# Altium schematic sheet 05. eMMC.SchDoc
size A3; DocumentNumber: 6; SheetNumber: 6; SheetTotal: 12
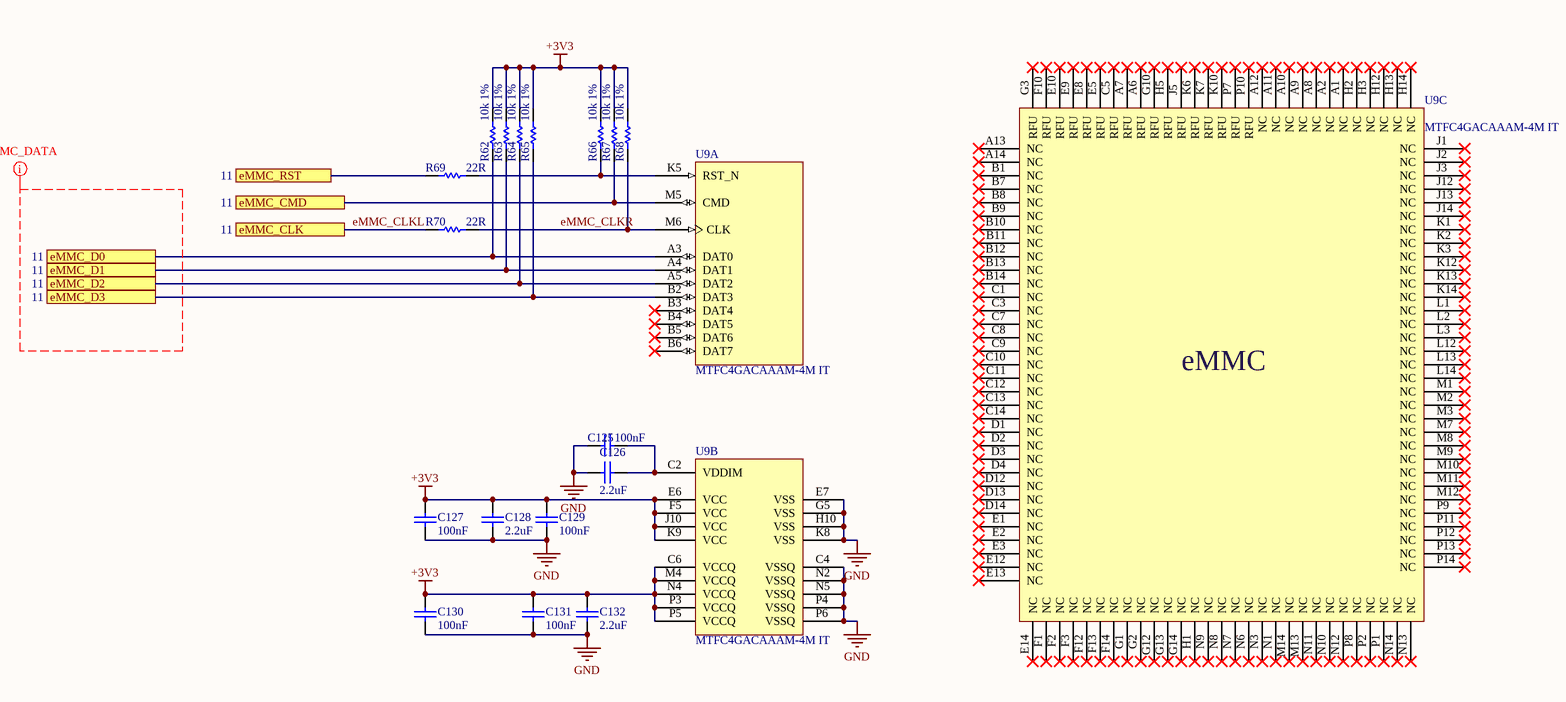
[diagram p0: 05. eMMC.SchDoc]

## Parts
C125  100nF  [CAPC1005X60X30LL05T10]
C126  2.2uF  [CAPC1608X90X35ML10T15]
C127  100nF  [CAPC1005X60X30LL05T10]
C128  2.2uF  [CAPC1005X60X30LL05T10]
C129  100nF  [CAPC1005X60X30LL05T10]
C130  100nF  [CAPC1005X60X30LL05T10]
C131  100nF  [CAPC1005X60X30LL05T10]
C132  2.2uF  [CAPC1608X90X35ML10T15]
R62  10k 1%  [RESC1005X40X25LL05T05]
R63  10k 1%  [RESC1005X40X25LL05T05]
R64  10k 1%  [RESC1005X40X25LL05T05]
R65  10k 1%  [RESC1005X40X25LL05T05]
R66  10k 1%  [RESC1005X40X25LL05T05]
R67  10k 1%  [RESC1005X40X25LL05T05]
R68  10k 1%  [RESC1005X40X25LL05T05]
R69  22R  [RESC1005X40X25LL05T05]
R70  22R  [RESC1005X40X25LL05T05]
U9  MTFC4GACAAAM-4M IT  [VFBGA-153]  (parts A,B,C of 3)

## Ports
eMMC_CLK (see 11), eMMC_CMD (see 11), eMMC_D0 (see 11), eMMC_D1 (see 11), eMMC_D2 (see 11), eMMC_D3 (see 11), eMMC_RST (see 11)

## Nets
+3V3: C127.2 C128.2 C129.2 C130.2 C131.2 C132.2 R62.2 R63.2 R64.2 R65.2 R66.2 R67.2 R68.2 U9.C6(VCCQ) U9.E6(VCC) U9.F5(VCC) U9.J10(VCC) U9.K9(VCC) U9.M4(VCCQ) U9.N4(VCCQ) U9.P3(VCCQ) U9.P5(VCCQ)
GND: C125.2 C126.2 C127.1 C128.1 C129.1 C130.1 C131.1 C132.1 U9.C4(VSSQ) U9.E7(VSS) U9.G5(VSS) U9.H10(VSS) U9.K8(VSS) U9.N2(VSSQ) U9.N5(VSSQ) U9.P4(VSSQ) U9.P6(VSSQ)
eMMC_CLKL: R70.1 ; port eMMC_CLK
eMMC_CLKR: R68.1 R70.2 U9.M6(CLK)
eMMC_CMD: R67.1 U9.M5(CMD) ; port eMMC_CMD
eMMC_D0: R62.1 U9.A3(DAT0) ; port eMMC_D0
eMMC_D1: R63.1 U9.A4(DAT1) ; port eMMC_D1
eMMC_D2: R64.1 U9.A5(DAT2) ; port eMMC_D2
eMMC_D3: R65.1 U9.B2(DAT3) ; port eMMC_D3
eMMC_RST: R69.1 ; port eMMC_RST
NetC125_1: C125.1 C126.1 U9.C2(VDDIM)
NetR66_1: R66.1 R69.2 U9.K5(RST_N)

Not connected (* = marked no-connect by the designer): U9 A1(NC)* A2(NC)* A6(RFU)* A7(RFU)* A8(NC)* A9(NC)* A10(NC)* A11(NC)* A12(NC)* A13(NC)* A14(NC)* B1(NC)* B3(DAT4)* B4(DAT5)* B5(DAT6)* B6(DAT7)* B7(NC)* B8(NC)* B9(NC)* B10(NC)* B11(NC)* B12(NC)* B13(NC)* B14(NC)* C1(NC)* C3(NC)* C5(RFU)* C7(NC)* C8(NC)* C9(NC)* C10(NC)* C11(NC)* C12(NC)* C13(NC)* C14(NC)* D1(NC)* D2(NC)* D3(NC)* D4(NC)* D12(NC)* D13(NC)* D14(NC)* E1(NC)* E2(NC)* E3(NC)* E5(RFU)* E8(RFU)* E9(RFU)* E10(RFU)* E12(NC)* E13(NC)* E14(NC)* F1(NC)* F2(NC)* F3(NC)* F10(RFU)* F12(NC)* F13(NC)* F14(NC)* G1(NC)* G2(NC)* G3(RFU)* G10(RFU)* G12(NC)* G13(NC)* G14(NC)* H1(NC)* H2(NC)* H3(NC)* H5(RFU)* H12(NC)* H13(NC)* H14(NC)* J1(NC)* J2(NC)* J3(NC)* J5(RFU)* J12(NC)* J13(NC)* J14(NC)* K1(NC)* K2(NC)* K3(NC)* K6(RFU)* K7(RFU)* K10(RFU)* K12(NC)* K13(NC)* K14(NC)* L1(NC)* L2(NC)* L3(NC)* L12(NC)* L13(NC)* L14(NC)* M1(NC)* M2(NC)* M3(NC)* M7(NC)* M8(NC)* M9(NC)* M10(NC)* M11(NC)* M12(NC)* M13(NC)* M14(NC)* N1(NC)* N3(NC)* N6(NC)* N7(NC)* N8(NC)* N9(NC)* N10(NC)* N11(NC)* N12(NC)* N13(NC)* N14(NC)* P1(NC)* P2(NC)* P7(RFU)* P8(NC)* P9(NC)* P10(RFU)* P11(NC)* P12(NC)* P13(NC)* P14(NC)*

## Layout directives
net class eMMC; rule Matched Net Lengths [Tolerance = 20mil]: (no net found under the mark)

## Notes on the sheet
- Title
- Size:
- Date:
- A4
- Number:
- Time:
- Revision:
- Sheet
- of
- N.S.T
- Design by:
- Check by:
- https://github.com/tung080827
- (in symbol CMP-2000-05234-1, part C) eMMC

## Library data of the parts
C125 C127 C129-C131 = CMP-2100-03641-1: Chip Capacitor, 0.1 uF, +/- 10%, 16 V, -55 to 125 degC, 0402 (1005 Metric), RoHS, Tape and Reel; Manufacturer: Murata; Material: Ceramic; Insulation Resistance: 10GR; Voltage: 16V; Dielectric: X7R; REACH SVHC: NoSVHC; Depth: 0.5mm; Case/Package: 0402; Datasheet URL: http://psearch.en.murata.com/capacitor/product/GRM155R71C104KA88%23.pdf; Lead Free: LeadFree; Dielectric Material: Ceramic; Manufacturer URL: http://www.murata.com/; Min Operating Temperature: -55degC; Length: 1mm; Case Code (Metric): 1005; Radiation Hardening: No; Package Reference: 0402; RoHSCompliant: true; Datasheet Version: 42675.0; Thickness: 0.022inch; Packaging: TapeandReel; Voltage Rating (DC): 16V; Tolerance: 10%; Max Operating Temperature: 125degC; Package Description: 2-Pin Surface Mount Device, Body 1 x 0.5 mm; Mount: SurfaceMount; Height: 0.5mm; Width: 0.5mm; Number of Pins: 2; Voltage Rating: 16V; Case Code (Imperial): 0402; Termination: SMD/SMT; Capacitance: 100nF; Package Quantity: 1
C126 C128 C132 = CMP-2006-02836-1: CAP 2.2uF 10V ±10% 0603 (1608 Metric) Thickness 0.6mm SMD; Manufacturer: Murata; Part Number: GRM188R71A225KE15D
R62-R68 = CMP-2002-08135-1: 10k 0.063W 1% 0402 (1005 Metric)  SMD; Manufacturer: Vishay Dale; Part Number: CRCW040210K0FKED
R69 R70 = CMP-1665-00027-3: Chip Resistor, 22 Ohm, +/- 1%, 0.1 W, -55 to 155 degC, 0402 (1005 Metric), RoHS, Tape and Reel; PartNumber: ERJ-2RKF22R0X; Case\/Package: 0402; Resistance: 22 Ohm; Power Rating: 100 mW; Voltage Rating: 50 V; ComponentLink2Description: Datasheet; Packaging: Tape and Reel; Weight: 2.8E-05oz; Pins: 2; Case Code (Imperial): 0402; Width: 0.5 mm; ComponentLink2URL: http://industrial.panasonic.com/cdbs/www-data/pdf/RDA0000/AOA0000C86.pdf; Height: 0.35 mm; PackageReference: 0402; REACH SVHC: Yes; Min Operating Temperature: -55 degC; Length: 1 mm; DatasheetVersion: 04/2015; RoHSCompliant: true; Package Quantity: 10000; Case Code (Metric): 1005; PackageDescription: 2-Pin Surface Mount Device, Body 1 x 0.5 mm; ComponentLink1URL: http://www.panasonic.com/; Mount: Surface Mount; Mounting Technology: Surface Mount; Tolerance: 1%; Max Operating Temperature: 155 degC; ComponentLink1Description: Manufacturer URL
U9 = CMP-2000-05234-1: e·MMC Memory, 4 Gb, 2.7 to 3.6 V, -40 to 85 degC, 153-Ball VFBGA, RoHS; Manufacturer: Micron; Operating Supply Voltage: 3.3V; Max Processing Temp: 260; Lead Finish: Tin|Silver|Copper; Package Reference: VFBGA-153; Package Description: 153-Ball Very Fine Pitch Ball Grid Array, Body 13 x 11.5 mm, Pitch 0.5 mm; Datasheet Version: Rev. E, 06/2014; Operating Temperature: -40to85C; Mounting: SurfaceMount; Manufacturer URL: https://www.micron.com/; Package URL: http://download.siliconexpert.com/pdfs/2015/2/24/1/20/24/252/mic_/manual/emmc_ps8210_v451_80s_153b_it.pdf; Datasheet URL: http://download.siliconexpert.com/pdfs/2015/2/24/1/20/24/252/mic_/manual/emmc_ps8210_v451_80s_153b_it.pdf